# EAGLE design I2C-AD4DA (EAGLE 7.7.0)

## Sheet 1 of 2
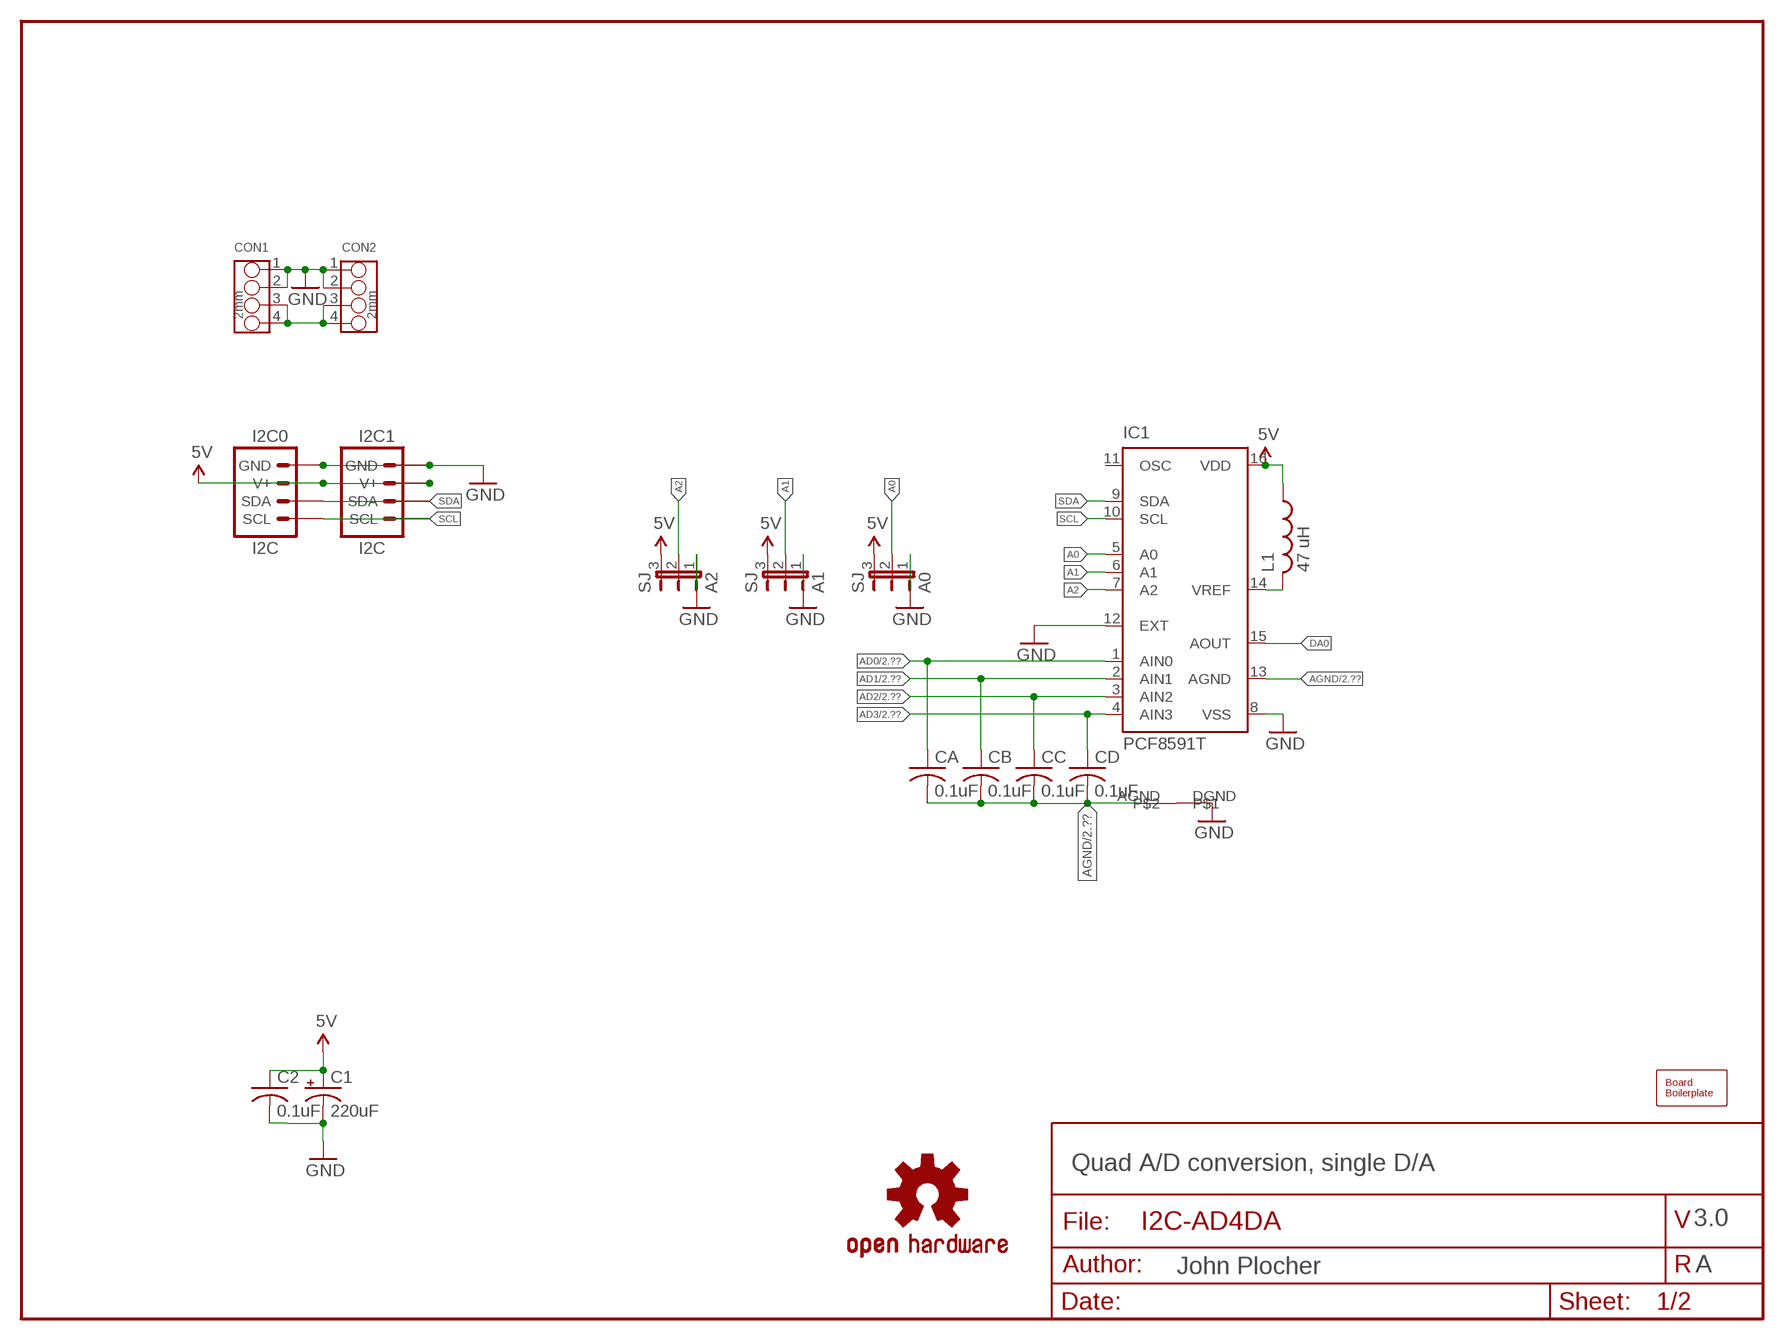
[diagram p0: schematic, sheet 1]

### Parts
A0  SJ  JUMPER-31-2  [SJ_3_PASTE1&2]
A1  SJ  JUMPER-31-2  [SJ_3_PASTE1&2]
A2  SJ  JUMPER-31-2  [SJ_3_PASTE1&2]
BOARD1  BOARD  BOARD80X100  [BOARD-DINRAIL-3.17INX10CM]
C1  220uF  CAP-POL0810  [0810-CAP]
C2  0.1uF  CAP0805  [0805-CAP]
CA  0.1uF  CAP0805  [0805-CAP]
CB  0.1uF  CAP0805  [0805-CAP]
CC  0.1uF  CAP0805  [0805-CAP]
CD  0.1uF  CAP0805  [0805-CAP]
CON1  2mm  CONNECTOR-GROVE-4P-2.0-3470130P1  [4P-2.0]
CON2  2mm  CONNECTOR-GROVE-4P-2.0-3470130P1  [4P-2.0]
I2C0  I2C  CONNECTOR-I2CLEFT  [I2C-L]
I2C1  I2C  CONNECTOR-I2CLEFT  [I2C-L]
IC1  PCF8591T  [SO16W]
L1  47 uH  L-USL2012C  [L2012C]
LOGO1  OSHW  DOC-OSHW-LOGO-L  [OSHW-LOGO-L]
U$1  AGND+DGND  [AGND+DGND]

### Nets
5V: A0.3 A1.3 A2.3 C1.+ C2.1 I2C0.V+ I2C0.V+@1(V+) I2C1.V+ I2C1.V+@1(V+) IC1.16(VDD) L1.1 ; also sheet 2
A0: A0.2 IC1.5(A0)
A1: A1.2 IC1.6(A1)
A2: A2.2 IC1.7(A2)
AD0: CA.1 IC1.1(AIN0) ; also sheet 2
AD1: CB.1 IC1.2(AIN1) ; also sheet 2
AD2: CC.1 IC1.3(AIN2) ; also sheet 2
AD3: CD.1 IC1.4(AIN3) ; also sheet 2
AGND: CA.2 CB.2 CC.2 CD.2 IC1.13(AGND) U$1.AGND ; also sheet 2
DA0: IC1.15(AOUT)
GND: A0.1 A1.1 A2.1 C1.- C2.2 CON1.1 CON1.2 CON2.1 CON2.2 I2C0.GND I2C0.GND@1(GND) I2C1.GND I2C1.GND@1(GND) IC1.8(VSS) IC1.12(EXT) U$1.DGND ; also sheet 2
N$1: IC1.14(VREF) L1.2
SCL: I2C0.SCL I2C0.SCL@1(SCL) I2C1.SCL I2C1.SCL@1(SCL) IC1.10(SCL)
SDA: I2C0.SDA I2C0.SDA@1(SDA) I2C1.SDA I2C1.SDA@1(SDA) IC1.9(SDA)
VIN: CON1.3 CON1.4 CON2.3 CON2.4
Unconnected: IC1.11(OSC)

### Notes on the sheet
- Quad A/D conversion, single D/A
- 3.0
- A

## Sheet 2 of 2
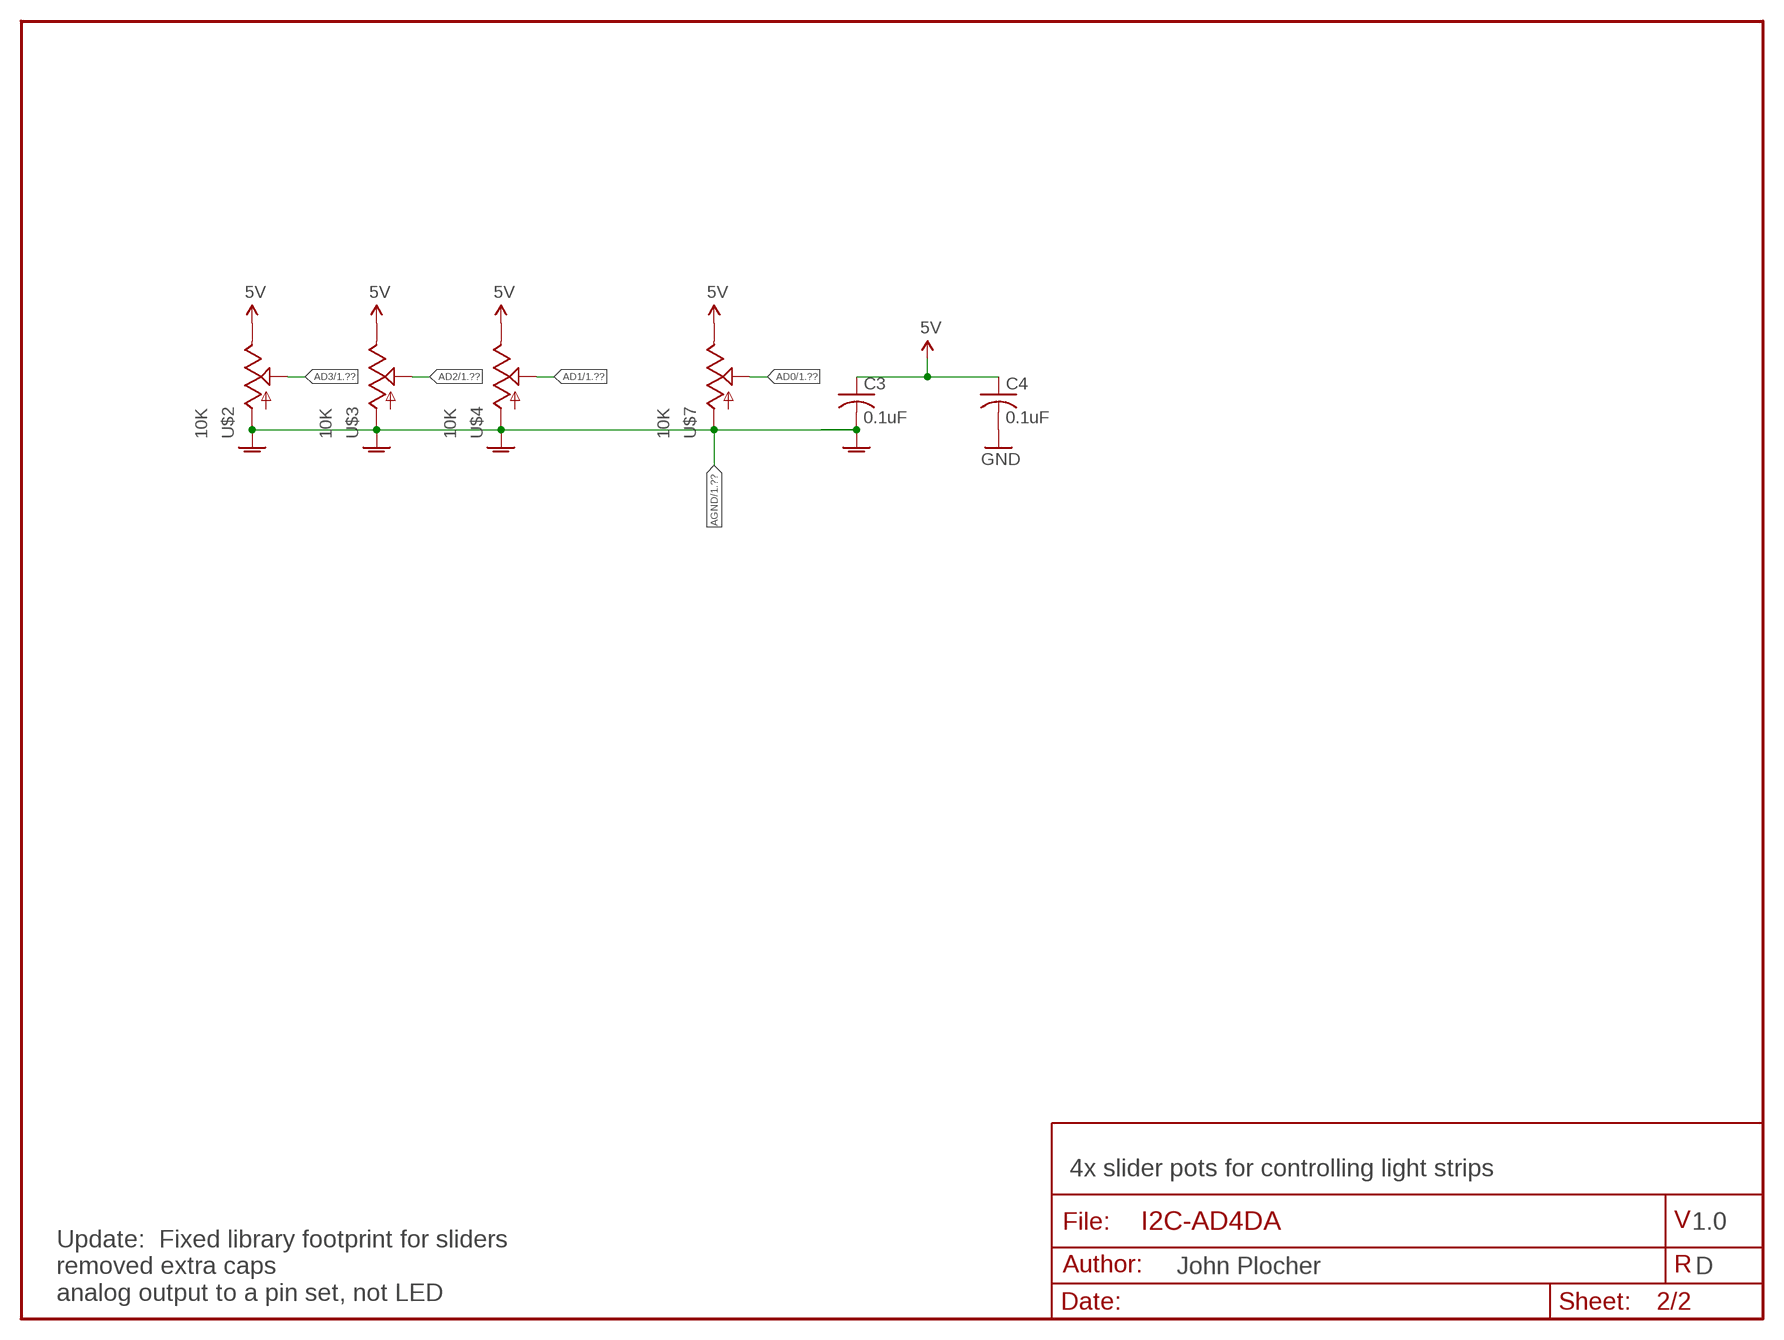
[diagram p1: schematic, sheet 2]

### Parts
C3  0.1uF  CAP0805  [0805-CAP]
C4  0.1uF  CAP0805  [0805-CAP]
U$2  10K  R-SLIDE-POT-45MM  [SLIDER-45MM]
U$3  10K  R-SLIDE-POT-45MM  [SLIDER-45MM]
U$4  10K  R-SLIDE-POT-45MM  [SLIDER-45MM]
U$7  10K  R-SLIDE-POT-45MM  [SLIDER-45MM]

### Nets
5V: C3.1 C4.1 U$2.E U$3.E U$4.E U$7.E ; also sheet 1
AD0: U$7.S ; also sheet 1
AD1: U$4.S ; also sheet 1
AD2: U$3.S ; also sheet 1
AD3: U$2.S ; also sheet 1
AGND: C3.2 U$2.A U$2.AGND@0(AGND) U$2.AGND@1(AGND) U$3.A U$3.AGND@0(AGND) U$3.AGND@1(AGND) U$4.A U$4.AGND@0(AGND) U$4.AGND@1(AGND) U$7.A U$7.AGND@0(AGND) U$7.AGND@1(AGND) ; also sheet 1
GND: C4.2 ; also sheet 1

### Notes on the sheet
- 4x slider pots for controlling light strips
- 1.0
- D
- Update:  Fixed library footprint for sliders
  removed extra caps
  analog output to a pin set, not LED

## Library data of the parts
A0 A1 A2 = SPCoast:JUMPER-3
BOARD1 = SPCoast:BOARD
C1 = SPCoast:CAP-POL*
C2-C4 CA CB CC CD = SPCoast:CAP*
CON1 CON2 = SPCoast:CONNECTOR-GROVE-4P-2.0
I2C0 I2C1 = SPCoast:CONNECTOR-I2C
IC1 = SPCoast:PCF8591: I2C-Bus D/A CONVERTER; MPN: PCF8591T/2,512; OC_FARNELL: 1826767; OC_NEWARK: 70R6911
L1 = SPCoast:L-US: INDUCTOR, American symbol
LOGO1 = SPCoast:DOC-OSHW-LOGO-: Open Source Hardware Logo This logo indicates the piece of hardware it is found on incorporates a OSHW license and/or adheres to the definition of open source hardware http://freedomdefined.org/OSHW Creative Commons - Attribution - ShareAlike 3.0
U$1 = SPCoast:AGND+DGND
U$2-U$4 U$7 = SPCoast:R-SLIDE-POT: Slide-type potentiometer- COM-9119

## Board
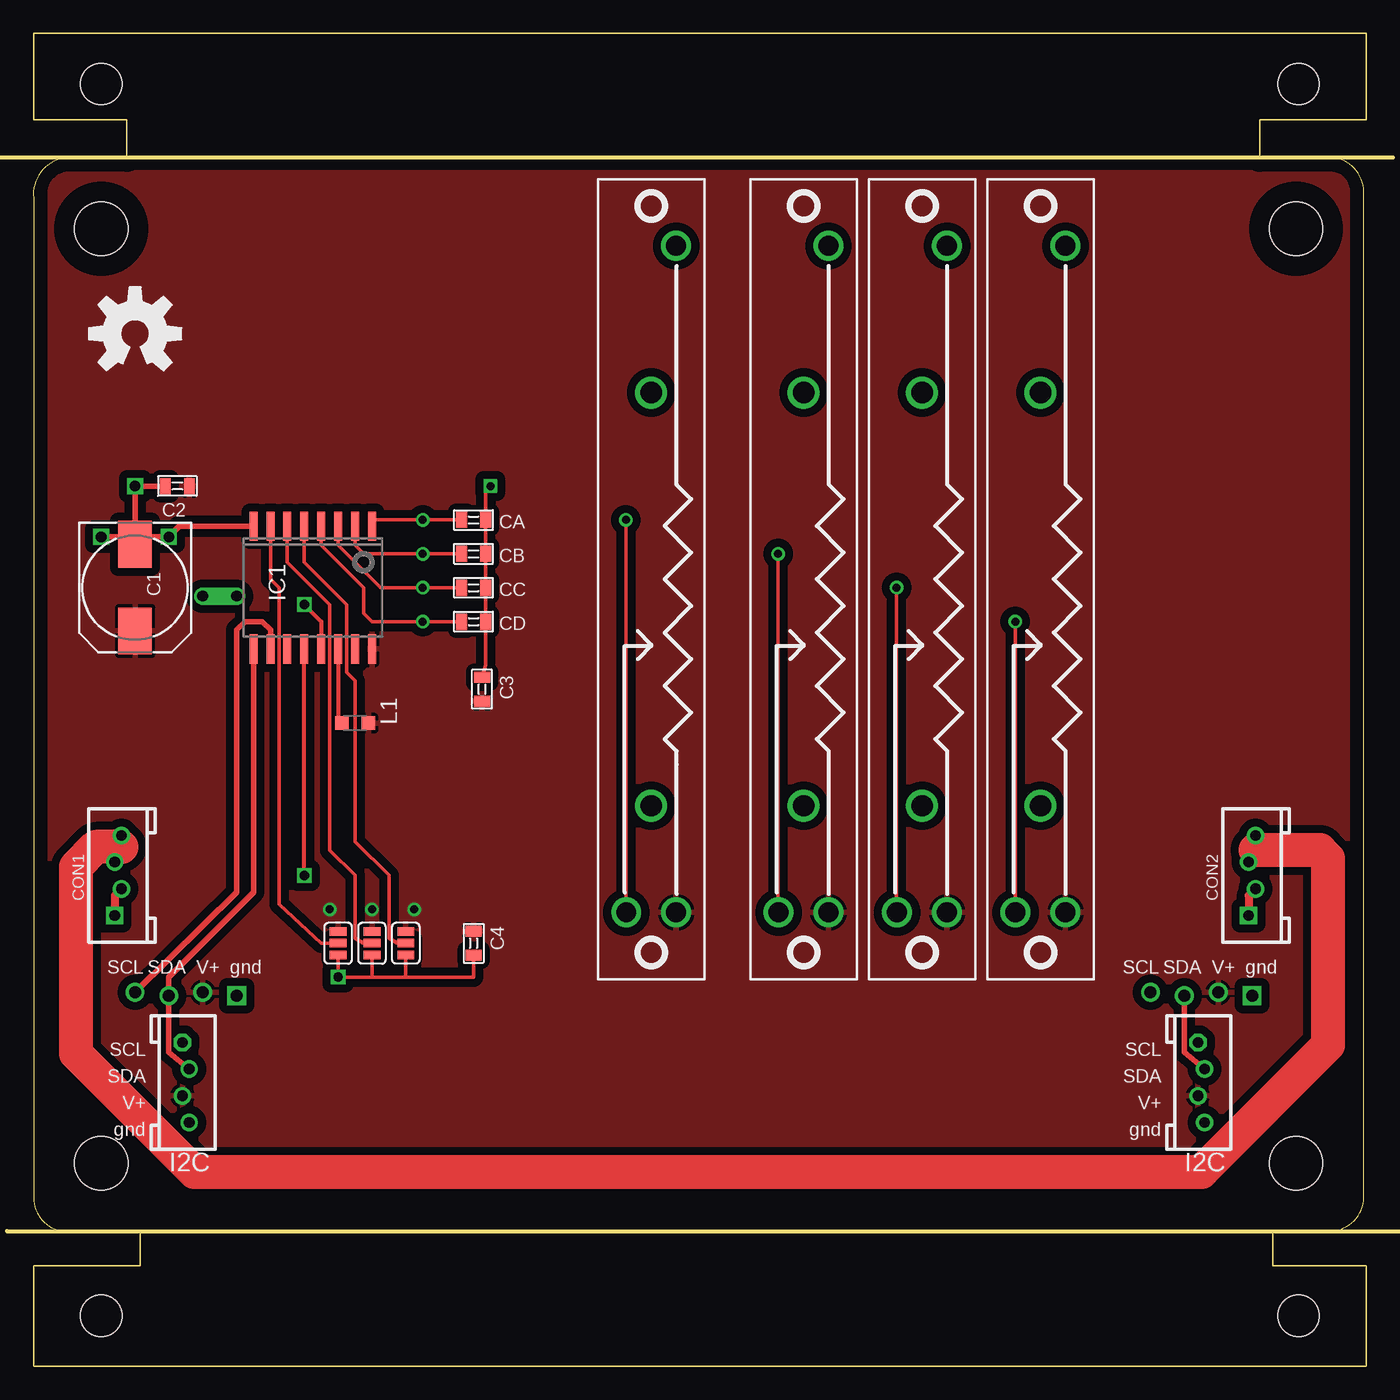
[diagram p2: board, top side]
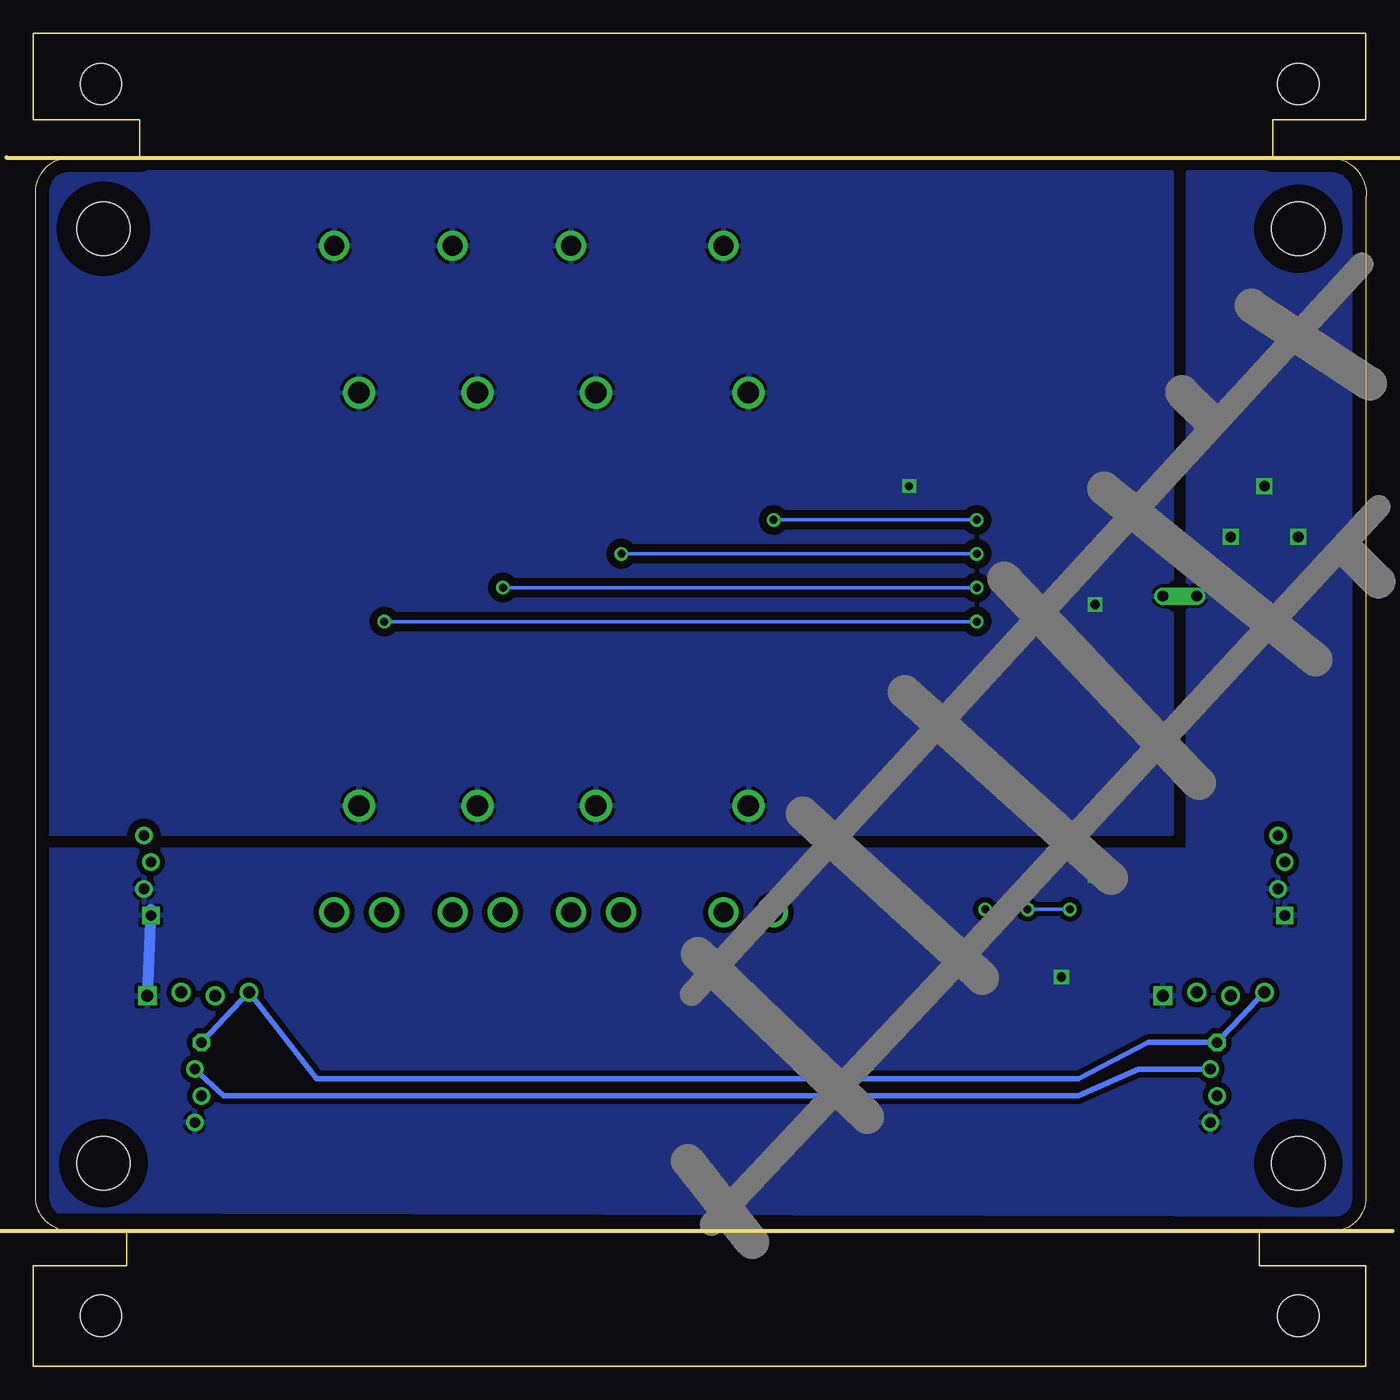
[diagram p3: board, bottom side, seen from below]

Size 100.01 x 100 mm. Coordinates in mm from the lower left corner, seen from the top.
Copper layers (1*16): Top 0.035mm / dielectric 1.5mm / Bottom 0.035mm
Design rules "default": minimum track width 10mil, minimum drill 0.6mm, track to track 8mil, track to pad 8mil, pad to pad 8mil, via to via 8mil, smd to smd 8mil, copper to edge 40mil, drill to drill 8mil, minimum pad ring 10mil, minimum via ring 8mil, stop-mask expansion 4mil, vias tented up to drill 0mil, thermal gap 10mil

### Footprints (pad centres in the part's own frame; a part is rotated, then mirrored left to right if it is on the bottom)
SJ_3_PASTE1&2 = smd 0.635 x 1.27: 1 -0.889,0; 2 0,0; 3 0.889,0
BOARD-DINRAIL-3.17INX10CM = hole 4: 94.742,15.24; 5.08,85.344; 94.742,85.344; 5.08,15.24 | hole 3.1: 5.08,96.19; 94.92,96.19; 5.08,3.81; 94.92,3.81
0810-CAP = smd 3.5 x 2.5: + 3.25,0; - -3.25,0
0805-CAP = smd 0.8 x 1.2: 1 -0.9,0; 2 0.9,0
4P-2.0 = drill 0.8 pad 1.27 square: 1 -3,0.254 | drill 0.8 pad 1.27: 2 -1,-0.254; 3 1,0.254; 4 3,-0.254
I2C-L = drill 0.9 square: GND 3.81,-0.127 | drill 0.8 pad 1.27: GND@1 0.254,-9.635; SDA@1 0.254,-5.635; V+@1 -0.254,-7.635 | drill 0.9: SCL -3.81,0.127; SDA -1.27,-0.127; V+ 1.27,0.127 | drill 0.8 pad 1.27 octagon: SCL@1 -0.254,-3.635
SO16W = smd 0.6 x 2.2: 1 -4.445,-4.6; 2 -3.175,-4.6; 3 -1.905,-4.6; 4 -0.635,-4.6; 5 0.635,-4.6; 6 1.905,-4.6; 7 3.175,-4.6; 8 4.445,-4.6; 9 4.445,4.6; 10 3.175,4.6; 11 1.905,4.6; 12 0.635,4.6; 13 -0.635,4.6; 14 -1.905,4.6; 15 -3.175,4.6; 16 -4.445,4.6
L2012C = smd 1 x 1: 1 -1,0; 2 1,0
AGND+DGND = drill 0.8 offset: AGND -1.27,0; DGND 1.27,0
SLIDER-45MM = drill 1.5: A 25,-1.875; E -25,-1.875; S -25,1.875 | drill 1.6: AGND@0 -17,0; AGND@1 14,0

### Placement (x,y rotation side)
A0  27.95,31.75 90 top
A1  25.41,31.75 90 top
A2  22.87,31.75 90 top
BOARD1  0.01,0 0 top
C1  7.63,58.42 270 top
C2  10.81,66.04 180 top
C3  33.67,50.8 90 top
C4  33.03,31.75 270 top
CA  33.03,63.5 0 top
CB  33.03,60.96 0 top
CC  33.03,58.42 0 top
CD  33.03,55.88 0 top
CON1  6.36,36.83 90 top
CON2  91.45,36.83 90 top
I2C0  11.44,27.94 0 top
I2C1  87.64,27.94 0 top
IC1  20.97,58.42 180 top
L1  24.14,48.26 180 top
LOGO1  7.63,77.47 0 top
U$1  13.98,57.78 180 top
U$2  75.58,59.05 90 top
U$3  66.69,59.05 90 top
U$4  57.8,59.05 90 top
U$7  46.37,59.05 90 top

### Tracks (layer width: path | path; a pad name or v marks a point on that pad's centre or on a via)
5V  (via drill 0.6)
  Bottom 0.254: v22.24,34.29 v25.41,34.29 v28.59,34.29
  pour Top (isolate 0.61): 0.01,89.53 100.01,89.53 100.01,9.79 0.01,9.53
A0
  Top 0.254: IC1.5 20.33,60.33 23.51,57.15 23.51,52.07 24.14,51.44 24.14,39.37 26.68,36.83 26.68,32.13 27.32,31.75 A0.2
A1
  Top 0.254: IC1.6 19.06,60.33 22.24,57.15 22.24,38.73 24.14,36.83 24.14,32.13 24.78,31.75 A1.2
A2
  Top 0.254: IC1.7 17.79,59.05 18.43,58.42 18.43,34.67 21.6,31.75 A2.2
AD0  (via drill 0.6)
  Top 0.254: CA.1 v29.22,63.5 25.41,63.5 IC1.1 | v44.46,63.5 44.46,34.09 U$7.S
  Bottom 0.254: v29.22,63.5 v44.46,63.5
AD1  (via drill 0.6)
  Top 0.254: CB.1 v29.22,60.96 24.78,60.96 24.14,61.59 IC1.2 | v55.89,60.96 55.89,34.09 U$4.S
  Bottom 0.254: v29.22,60.96 v55.89,60.96
AD2  (via drill 0.6)
  Top 0.254: CC.1 v29.22,58.42 26.05,58.42 22.87,61.59 IC1.3 | v64.78,58.42 64.78,34.09 U$3.S
  Bottom 0.254: v29.22,58.42 v64.78,58.42
AD3  (via drill 0.6)
  Top 0.254: CD.1 v29.22,55.88 25.41,55.88 24.78,56.52 24.78,58.42 21.6,61.59 IC1.4 | v73.67,55.88 73.67,34.09 U$2.S
  Bottom 0.254: v29.22,55.88 v73.67,55.88
AGND  (via drill 0.6, 0.7)
  Top 0.254: v34.3,66.04 33.93,65.67 CA.2 CB.2 CC.2 CD.2 33.93,52.6 C3.2
  Top 0.305: IC1.13 21.6,55.88 v20.33,57.15
  pour Bottom (isolate 0.61): 14.62,40.01 14.62,89.53 99.84,89.53 99.84,40.01
GND  (via drill 0.7, 0.8)
  Top 0.254: A2.1 v22.87,29.21 25.41,29.21 | A1.1 25.41,29.21 | A0.1 27.95,29.21 | 27.95,29.21 25.41,29.21 | C4.2 33.03,29.21 27.95,29.21
  Top 0.305: v20.33,36.83 IC1.12
  Top 0.406: 16.52,63.5 IC1.8 10.96,63.02 v10.17,62.23 7.63,62.23 v7.63,66.04 C2.2 | v5.09,62.23 7.49,62.23 C1.-
  Top 0.61: CON1.2 6.11,35.32 CON1.1 | CON2.2 91.2,35.32 CON2.1
  Bottom 0.813: CON2.1 91.2,34.29 I2C1.GND
  pour Bottom (isolate 0.406): 0.01,89.53 13.35,89.53 13.35,38.73 100.19,38.73 100.19,11.7 0.01,11.43
N$1
  Top 0.305: IC1.14 22.87,48.53 L1.2
SCL
  Top 0.406: IC1.10 17.79,55.24 17.16,55.88 15.89,55.88 15.25,55.24 15.25,35.56 I2C0.SCL
  Bottom 0.406: I2C0.SCL 10,25.57 I2C0.SCL@1 16.35,24.3 21.6,21.59 78.75,21.59 I2C1.SCL 83.83,28.11 I2C1.SCL@1
SDA
  Top 0.406: I2C0.SDA@1 10.17,23.57 I2C0.SDA 10.17,29.21 16.52,35.56 IC1.9 | I2C1.SDA 86.37,23.57 I2C1.SDA@1
  Bottom 0.406: I2C0.SDA@1 17.08,22.3 21.6,20.32 85.74,20.32 I2C1.SDA@1
VIN
  Top 0.61: CON1.3 6.62,38.97 CON1.4 | CON2.3 91.71,38.34 91.71,38.73 CON2.4
  Top 2.54: 6.62,38.97 4.7,38.97 3.19,37.47 3.19,23.5 12.08,14.61 87.64,14.61 97.17,24.13 97.17,38.1 96.53,38.73 91.71,38.73

### Text on the board
tDocu: v3.0 | 2019-04 | OSHW | John Plocher | LightUI | I2C-AD4DA | Vin | Vin | 5v | 5v | 0 1 | AD0 | AD1 | AD2 | AD3 | Board / Address | W | R G B | LightUI | I2C-AD4DA
bDocu: Solder Side | Made in the PCR, Coast Division, NMRA | AD4DA | Go Bears! | Model Railroading is fun! | LightUI | www . SPCoast . com | I2C / Address | A2 A1 A0 | *B0: 0 0 0 0x48 | B1: 0 0 1 0x49 | B2: 0 1 0 0x4A | B3: 0 1 1 0x4B | B4: 1 0 0 0x4C | Board / Address | B5: 1 0 1 0x4D | B6: 1 1 0 0x4E | B7: 1 1 1 0x3F